# Altium schematic sheet Misc.SchDoc
size A4; SheetNumber: 10; SheetTotal: 10
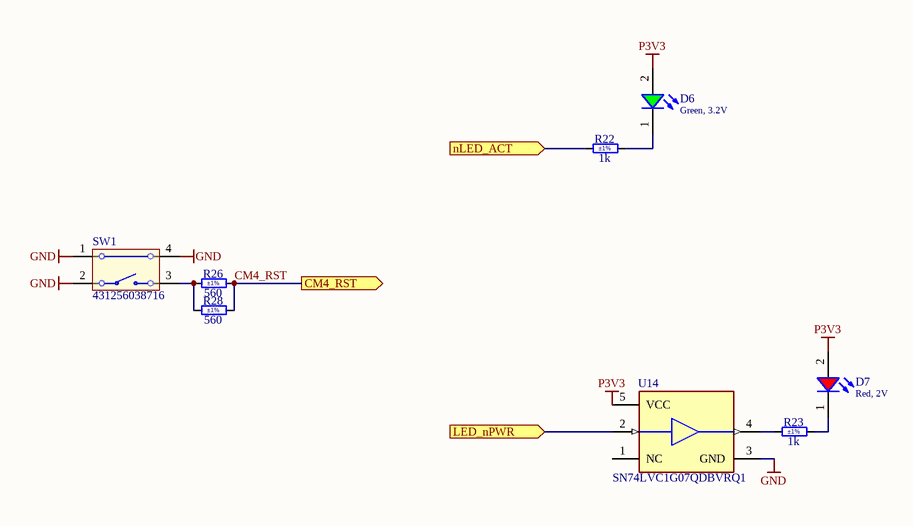
[diagram p0: Misc.SchDoc]

## Parts
D6  Green, 3.2V  [WL-SMSW_0603_Rectangular]
D7  Red, 2V  [WL-SMSW_0603_Rectangular]
R22  1k  Tolerance: ±1%  [RESC1005X40N]
R23  1k  Tolerance: ±1%  [RESC1005X40N]
R26  560  Tolerance: ±1%  [RESC1005X40N]
R28  560  Tolerance: ±1%  [RESC1005X40N]
SW1  431256038716  [431256038716]
U14  SN74LVC1G07QDBVRQ1  [FP-DBV0005A-IPC_A]

## Ports
CM4_RST (out), LED_nPWR (in), nLED_ACT (in)

## Nets
GND: SW1.1 SW1.2 SW1.4 U14.3(GND)
P3V3: D6.2(A) D7.2(A) U14.5(VCC)
CM4_RST: R26.2 R28.2 ; port CM4_RST
LED_nPWR: U14.2(A) ; port LED_nPWR
nLED_ACT: R22.1 ; port nLED_ACT
NetD6_1: D6.1(K) R22.2
NetD7_1: D7.1(K) R23.2
NetR23_1: R23.1 U14.4(Y)
NetR26_1: R26.1 R28.1 SW1.3

Not connected (* = marked no-connect by the designer): U14 1(NC)

## Library data of the parts
D6 = 155060GS75300: WL-SMSW SMT Mono-color Side View Waterclear, size 0603, Green, 3.2V, 140deg; Manufacturer: Wurth Elektronik; Chip Technology: InGaN; Dominant Wavelength typ.: 525nm; Luminous Intensity typ.: 560mcd; Peak Wavelength typ.: 515nm; Viewing Angle: 140deg; ComponentLink1Description: Manufacturer; ComponentLink1URL: http://www.we-online.de; ComponentLink2URL: https://www.we-online.com/catalog/datasheet/155060GS75300.pdf; ComponentLink2Description: Datasheet; Forward Voltage typ.: 3.2V; Emitting Color: Green; Mounting Technology: SMT; Operating Temperature: -40 to +85degC; Published Date: October 2020; Manufacturer Part Number: 155060GS75300; Packaging: Tape and Reel; Size: 0603
D7 = 155060RS75300: WL-SMSW SMT Mono-color Side View Waterclear, size 0603, Red, 2V, 140deg; Manufacturer: Wurth Elektronik; Chip Technology: AlInGaP; Dominant Wavelength typ.: 625nm; Luminous Intensity typ.: 150mcd; Peak Wavelength typ.: 630nm; Viewing Angle: 140deg; ComponentLink1Description: Manufacturer; ComponentLink1URL: http://www.we-online.de; ComponentLink2URL: https://www.we-online.com/catalog/datasheet/155060RS75300.pdf; ComponentLink2Description: Datasheet; Forward Voltage typ.: 2V; Emitting Color: Red; Mounting Technology: SMT; Operating Temperature: -40 to +85degC; Published Date: October 2020; Manufacturer Part Number: 155060RS75300; Packaging: Tape and Reel; Size: 0603
R22 R23 = R0402_1K_1%_0.0625W_100PPM: Resistor - 1%; Part Description: General Purpose Thick Film Chip Resistor; Manufacturer: GENERIC; Manufacturer1 Part Number: 232270671002L; TC: ±100ppm/°C; PressFit: No; Part Number: R0402_1K_1%_0.0625W_100PPM; Component Kind: Standard; Component Type: Standard; Pin Count: 2; Value: 1k; Status: Not Recommended; Power: 0.0625W; Manufacturer Part Number: R0402_1K_1%_0.0625W_100PPM; Case: 0402; Mounted: Yes; Sense: No; Socket: No; SMD: Yes; Manufacturer1 Example: YAGEO PHYCOMP; Manufacturer1 ComponentHeight: 0.4mm; HelpURL: \\cern.ch\dfs\Applications\Altium\Datasheets\R0402_Phycomp_RC0402.pdf; Author: CERN DEM JLC; CreateDate: 03.12.2007; LatestRevisionDate: 17.10.2012
R26 R28 = R0402_560R_1%_0.0625W_100PPM: Resistor - 1%; Part Description: General Purpose Thick Film Chip Resistor; Manufacturer: GENERIC; Manufacturer1 Part Number: 232270675601L; TC: ±100ppm/°C; PressFit: No; Part Number: R0402_560R_1%_0.0625W_100PPM; Component Kind: Standard; Component Type: Standard; Pin Count: 2; Value: 560; Status: Not Recommended; Power: 0.0625W; Manufacturer Part Number: R0402_560R_1%_0.0625W_100PPM; Case: 0402; Mounted: Yes; Sense: No; Socket: No; SMD: Yes; Manufacturer1 Example: YAGEO PHYCOMP; Manufacturer1 ComponentHeight: 0.4mm; HelpURL: \\cern.ch\dfs\Applications\Altium\Datasheets\R0402_Phycomp_RC0402.pdf; Author: CERN DEM JLC; CreateDate: 03.12.2007; LatestRevisionDate: 17.10.2012
SW1 = CMP-1458-00004-1: WS-TATU THT Tact Switch 6X6 mm right angle type with ground terminal; Manufacturer: Wuerth Elektronik; NoPins: 04; PackageReference: 431256038716; ComponentLink2URL: http://katalog.we-online.de/em/datasheet/43125603x.pdf; ComponentLink2Description: Datasheet; ComponentLink1URL: http://www.we-online.com; ComponentLink1Description: Manufacturer URL; PartNumber: 431256038716
U14 = CMP-0859-00130-4: IC BUF NON-INVERT 5.5V SOT23-5; Quiescent Current: 10uA; Number of Channels: 1; Low Level Output Current: 32mA; Logic Function: Buffer; Turn-On Delay Time: 9.8ns; Polarity: Non-Inverting; Min Supply Voltage: 1.65V; Max Operating Temperature: 125°C; Number of Inputs: 1; Lead Free: Lead Free; Max Supply Voltage: 5.5V; Packaging: Tape and Reel; RoHS Compliant: Yes; Number of Pins: 5; Number of Input Lines: 1; Number of Outputs: 1; Technology: CMOS; Number of Bits: 1; Number of Gates: 1; Case/Package: SOT-23-5; Propagation Delay: 9.8ns; Series: 74LVC; Number of Elements: 1; Package Quantity: 3000; Number of Bits per Element: 1; Mount: Surface Mount; Number of Output Lines: 1; Min Operating Temperature: -40°C